# Altium schematic sheet power&usb.SchDoc
size A4
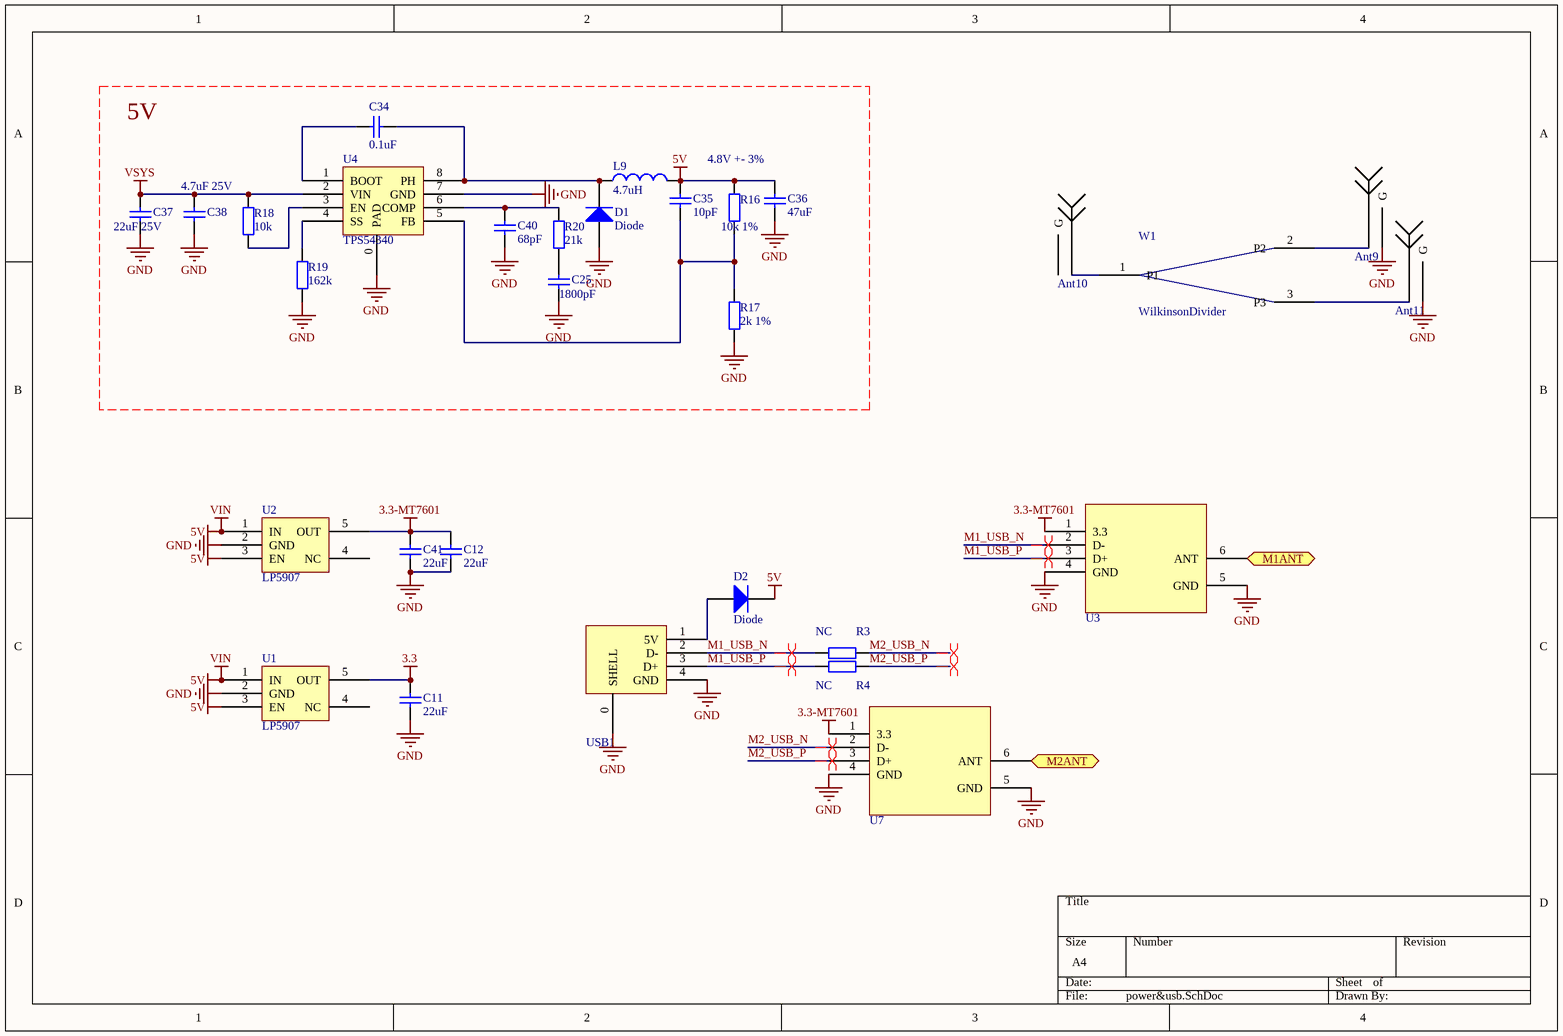
[diagram p0: power&usb.SchDoc]

## Parts
Ant9  Antenna  [SMA-2]  (value not drawn)
Ant10  Antenna  [SMA-2]  (value not drawn)
Ant11  Antenna  [SMA-2]  (value not drawn)
C11  value 22uF  [0805]  (hidden comment: Cap)
C12  value 22uF  [0805]  (hidden comment: Cap)
C25  value 1800pF  [0402]  (hidden comment: Cap)
C34  value 0.1uF  [0402]  (hidden comment: Cap)
C35  value 10pF  [0402]  (hidden comment: Cap)
C36  value 47uF  [1210]  (hidden comment: Cap)
C37  value 22uF 25V  [1210]  (hidden comment: Cap)
C38  value 4.7uF 25V  [0805]  (hidden comment: Cap)
C40  value 68pF  [0402]  (hidden comment: Cap)
C41  value 22uF  [0805]  (hidden comment: Cap)
D1  Diode  [LC-SMB(DO-214AA)_S1]
D2  Diode  [0805]
L9  value 4.7uH  [L7022]  (hidden comment: Inductor)
R3  value NC  [0402]  (hidden comment: Res2)
R4  value NC  [0402]  (hidden comment: Res2)
R16  value 10k 1%  [0402]  (hidden comment: Res2)
R17  value 2k 1%  [0402]  (hidden comment: Res2)
R18  value 10k  [0402]  (hidden comment: Res2)
R19  value 162k  [0402]  (hidden comment: Res2)
R20  value 21k  [0402]  (hidden comment: Res2)
U1  LP5907  [SOT23-5]
U2  LP5907  [SOT23-5]
U3  MT7601-Module  [MT7601-Module]  (value not drawn)
U4  TPS54340  [D8-Pad]
U7  MT7601-Module  [MT7601-Module]  (value not drawn)
USB1  USB-A  [USB-A-Male]  (value not drawn)
W1  WilkinsonDivider  [WilkinsonDivider]

## Ports
M1ANT, M2ANT

## Nets
3.3: C11.2 U1.5(OUT)
3.3-MT7601: C12.2 C41.2 U2.5(OUT) U3.1(3.3) U7.1(3.3)
5V: C35.1 C36.1 D2.2(K) L9.2 R16.1 U1.1(IN) U1.3(EN) U2.1(IN) U2.3(EN)  [also labelled VIN]
GND: Ant9.GND(G) Ant11.GND(G) C11.1 C12.1 C25.2 C36.2 C37.2 C38.2 C40.2 C41.1 D1.1(A) R17.2 R19.2 U1.2(GND) U2.2(GND) U3.4(GND) U3.5(GND) U4.0(PAD) U4.7(GND) U7.4(GND) U7.5(GND) USB1.0(SHELL) USB1.4(GND)
VSYS: C37.1 C38.1 R18.1 U4.2(VIN)
M1_USB_N: R3.2 U3.2(D-) USB1.2(D-)
M1_USB_P: R4.2 U3.3(D+) USB1.3(D+)
M1ANT: U3.6(ANT) ; port M1ANT
M2_USB_N: R3.1 U7.2(D-)
M2_USB_P: R4.1 U7.3(D+)
M2ANT: U7.6(ANT) ; port M2ANT
NetAnt9_1: Ant9.1 W1.2(P2)
NetAnt10_1: Ant10.1 W1.1(P1)
NetAnt11_1: Ant11.1 W1.3(P3)
NetC25_1: C25.1 R20.2
NetC34_1: C34.1 D1.2(K) L9.1 U4.8(PH)
NetC34_2: C34.2 U4.1(BOOT)
NetC35_2: C35.2 R16.2 R17.1 U4.5(FB)
NetC40_1: C40.1 R20.1 U4.6(COMP)
NetD2_1: D2.1(A) USB1.1(5V)
NetR18_2: R18.2 U4.3(EN)
NetR19_1: R19.1 U4.4(SS)

Not connected (* = marked no-connect by the designer): Ant10 GND(G); U1 4(NC); U2 4(NC)

## Layout directives
differential pair: M1_USB_N, M1_USB_P, M2_USB_N, M2_USB_P

## Notes on the sheet
- 5V
- 4.8V +- 3%

## Library data of the parts
C11 C12 C25 C34-C38 C40 C41 = Cap: Capacitor; Published: 8-Jun-2000; LatestRevisionDate: 17-Jul-2002; LatestRevisionNote: Re-released for DXP Platform.; PackageReference: RAD-0.3; Publisher: Altium Limited; PackageDescription: Radial Cap, Thru-Hole; 2 Leads; 0.3 in Pin Spacing
D1 D2 = Diode: Default Diode; Published: 8-Jun-2000; LatestRevisionDate: 17-Jul-2002; LatestRevisionNote: Re-released for DXP Platform.; PackageVersion: Sep-1996; PackageReference: SMC; Publisher: Altium Limited; PackageDescription: DO-214-AB/SMC; 2 C-Bend Leads; Body 7.9 x 5.9 mm, inc. leads (LxW); Code_JEDEC: DO-214-AB
L9 = Inductor: Code_IEC: 1005; Published: 8-Jun-2000; LatestRevisionDate: 29-May-2009; LatestRevisionNote: IPC-7351 Footprint Added.; PackageReference: 0402-A; Publisher: Altium Limited; PackageDescription: Chip Inductor; Code_JEITA: 0402
R3 R4 R16-R20 = Res2: Resistor; Published: 8-Jun-2000; LatestRevisionDate: 17-Jul-2002; LatestRevisionNote: Re-released for DXP Platform.; PackageReference: AXIAL-0.4; Publisher: Altium Limited; PackageDescription: Axial Device, Thru-Hole; 2 Leads; 0.4 in Pin Spacing